# Altium schematic sheet 通信模块.SchDoc: 通信模块
size A4; Author: GAOYANG; Organization: Altium Limited; Address1: L3, 12a Rodborough Rd; Address2: Frenchs Forest; Address3: NSW; Address4: Australia 2086
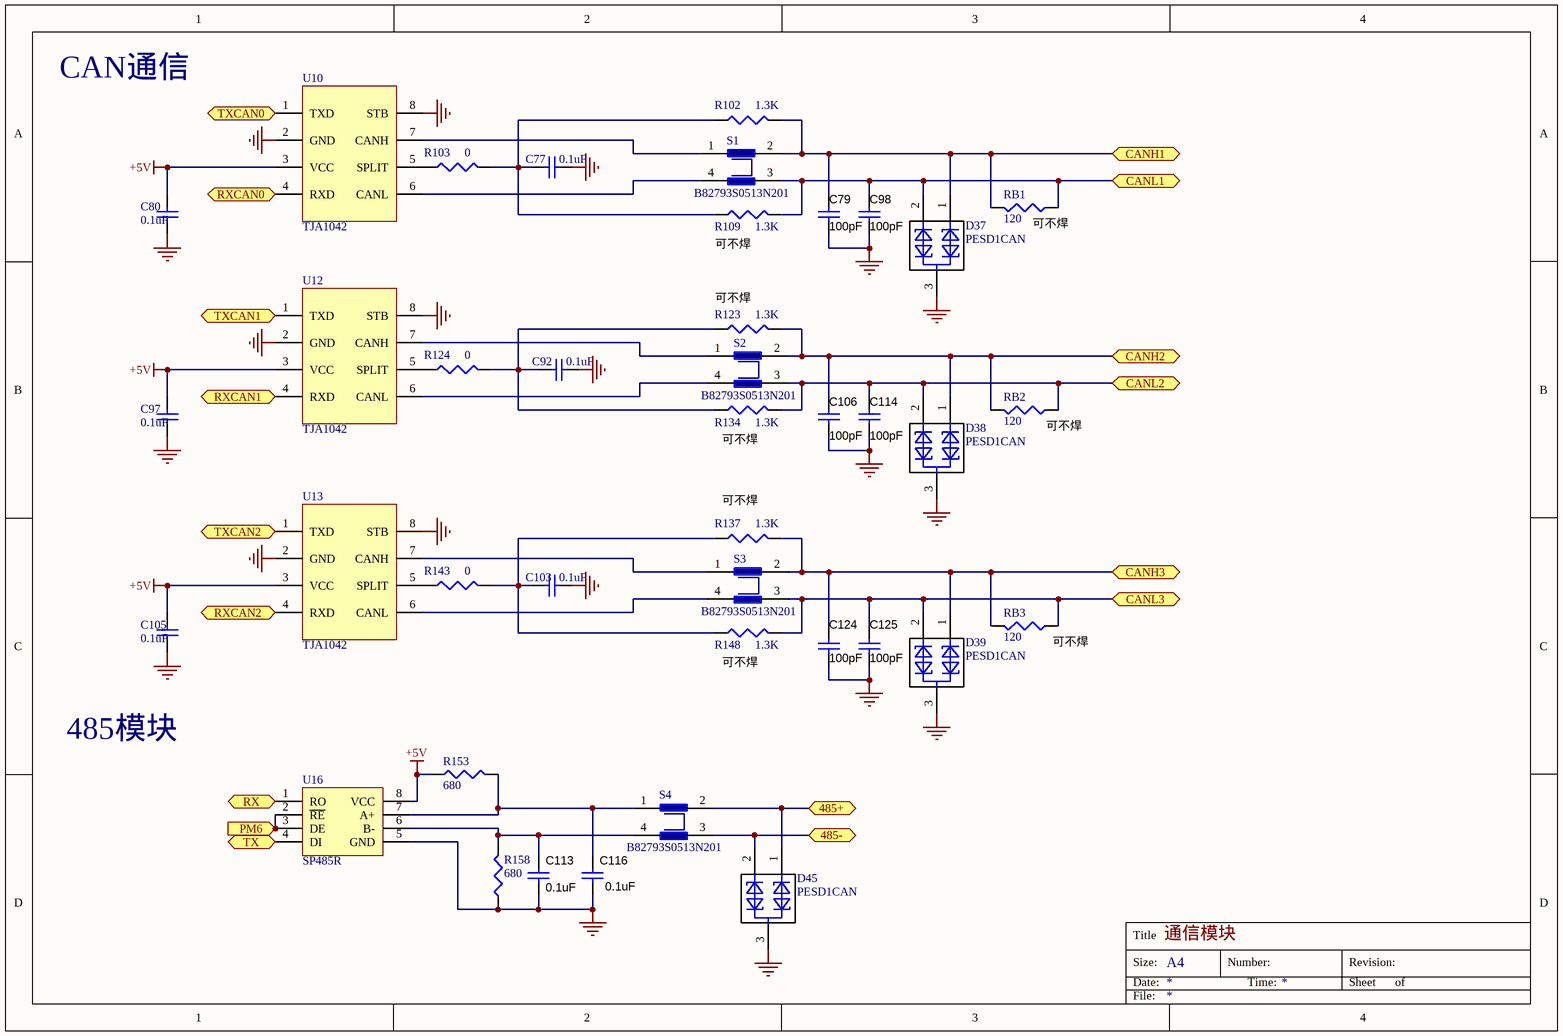
[diagram p0: 通信模块.SchDoc]

## Parts
C77  value 0.1uF  [0603-L]  (hidden comment: Cap)
C79  value 100pF  [0603-L]  (hidden comment: CC0603JRNPO9BN101)
C80  value 0.1uF  [0603-L]  (hidden comment: Cap)
C92  value 0.1uF  [0603-L]  (hidden comment: Cap)
C97  value 0.1uF  [0603-L]  (hidden comment: Cap)
C98  value 100pF  [0603-L]  (hidden comment: CC0603JRNPO9BN101)
C103  value 0.1uF  [0603-L]  (hidden comment: Cap)
C105  value 0.1uF  [0603-L]  (hidden comment: Cap)
C106  value 100pF  [0603-L]  (hidden comment: CC0603JRNPO9BN101)
C113  value 0.1uF  [0603-CAPACITOR]  (hidden comment: C1608C0G1H200JT)
C114  value 100pF  [0603-L]  (hidden comment: CC0603JRNPO9BN101)
C116  value 0.1uF  [0603-CAPACITOR]  (hidden comment: C1608C0G1H200JT)
C124  value 100pF  [0603-L]  (hidden comment: CC0603JRNPO9BN101)
C125  value 100pF  [0603-L]  (hidden comment: CC0603JRNPO9BN101)
D37  PESD1CAN  [SOT23,PESD1CAN,TO-236B]
D38  PESD1CAN  [SOT23,PESD1CAN,TO-236B]
D39  PESD1CAN  [SOT23,PESD1CAN,TO-236B]
D45  PESD1CAN  [SOT23,PESD1CAN,TO-236B]
R102  value 1.3K  [RES0805]  (hidden comment: Res3)
R103  value 0  [0603-L]  (hidden comment: Res3)
R109  value 1.3K  [RES0805]  (hidden comment: Res3)
R123  value 1.3K  [RES0805]  (hidden comment: Res3)
R124  value 0  [0603-L]  (hidden comment: Res3)
R134  value 1.3K  [RES0805]  (hidden comment: Res3)
R137  value 1.3K  [RES0805]  (hidden comment: Res3)
R143  value 0  [0603-L]  (hidden comment: Res3)
R148  value 1.3K  [RES0805]  (hidden comment: Res3)
R153  value 680  [J1-0603]  (hidden comment: Res3)
R158  value 680  [J1-0603]  (hidden comment: Res3)
RB1  value 120  [RES1206]  (hidden comment: Res3)
RB2  value 120  [RES1206]  (hidden comment: Res3)
RB3  value 120  [RES1206]  (hidden comment: Res3)
S1  B82793S0513N201  [SMD]
S2  B82793S0513N201  [SMD]
S3  B82793S0513N201  [SMD]
S4  B82793S0513N201  [SMD]
U10  TJA1042  [TJA10]
U12  TJA1042  [TJA10]
U13  TJA1042  [TJA10]
U16  SP485R  [U16]

## Ports
485+ (bidir), 485- (bidir), CANH1 (bidir), CANH2 (bidir), CANH3 (bidir), CANL1 (bidir), CANL2 (bidir), CANL3 (bidir), PM6 (in), RX (out), RXCAN0 (out), RXCAN1 (out), RXCAN2 (out), TX (in), TXCAN0 (in), TXCAN1 (in), TXCAN2 (in)

## Nets
+5V: C80.1 C97.1 C105.1 R153.1 U10.3(VCC) U12.3(VCC) U13.3(VCC) U16.8(VCC)
GND: C77.2 C79.1 C80.2 C92.2 C97.2 C98.1 C103.2 C105.2 C106.1 C113.2 C114.1 C116.2 C124.1 C125.1 D37.3 D38.3 D39.3 D45.3 R158.1 U10.2(GND) U10.8(STB) U12.2(GND) U12.8(STB) U13.2(GND) U13.8(STB) U16.5(GND)
485+: D45.1 S4.2 ; port 485+
485-: D45.2 S4.3 ; port 485-
CANH1: C79.2 D37.1 R102.1 RB1.2 S1.2 ; port CANH1
CANH2: C106.2 D38.1 R123.1 RB2.2 S2.2 ; port CANH2
CANH3: C124.2 D39.1 R137.1 RB3.2 S3.2 ; port CANH3
CANL1: C98.2 D37.2 R109.1 RB1.1 S1.3 ; port CANL1
CANL2: C114.2 D38.2 R134.1 RB2.1 S2.3 ; port CANL2
CANL3: C125.2 D39.2 R148.1 RB3.1 S3.3 ; port CANL3
PM6: U16.2(~{RE}) U16.3(DE) ; port PM6
RX: U16.1(RO) ; port RX
RXCAN0: U10.4(RXD) ; port RXCAN0
RXCAN1: U12.4(RXD) ; port RXCAN1
RXCAN2: U13.4(RXD) ; port RXCAN2
TX: U16.4(DI) ; port TX
TXCAN0: U10.1(TXD) ; port TXCAN0
TXCAN1: U12.1(TXD) ; port TXCAN1
TXCAN2: U13.1(TXD) ; port TXCAN2
NetC77_1: C77.1 R102.2 R103.1 R109.2
NetC92_1: C92.1 R123.2 R124.1 R134.2
NetC103_1: C103.1 R137.2 R143.1 R148.2
NetC113_1: C113.1 R158.2 S4.4 U16.6(B-)
NetC116_1: C116.1 R153.2 S4.1 U16.7(A+)
NetR103_2: R103.2 U10.5(SPLIT)
NetR124_2: R124.2 U12.5(SPLIT)
NetR143_2: R143.2 U13.5(SPLIT)
NetS1_1: S1.1 U10.7(CANH)
NetS1_4: S1.4 U10.6(CANL)
NetS2_1: S2.1 U12.7(CANH)
NetS2_4: S2.4 U12.6(CANL)
NetS3_1: S3.1 U13.7(CANH)
NetS3_4: S3.4 U13.6(CANL)

## Notes on the sheet
- CAN通信
- (near R109) 可不焊
- (near RB1) 可不焊
- (near R123) 可不焊
- (near R134) 可不焊
- (near RB2) 可不焊
- (near R137) 可不焊
- (near RB3) 可不焊
- (near R148) 可不焊
- 485模块
- Title
- Size:
- Date:
- A4
- Number:
- Time:
- Revision:
- Sheet
- of
- File:

## Library data of the parts
C77 C80 C92 C97 C103 C105 = Cap: Ceramic, X7R, 100V, 10%, 0603; Published: 8-Jun-2000; LatestRevisionDate: 17-Jul-2002; LatestRevisionNote: Re-released for DXP Platform.; PackageReference: RAD-0.3; Publisher: Altium Limited; PackageDescription: Radial Cap, Thru-Hole; 2 Leads; 0.3 in Pin Spacing
C79 C98 C106 C114 C124 C125 = CC0603JRNPO9BN101: Ceramic, X7R, 50V, 5%, 0603; Manufacturer: YAGEO; Cap_Case: 0603; Polarized: N; TaMax_C: 125; TaMin_C: -55; Tolerance_%: 5; VDC_V: 50; CompType: Capacitor; Value1: 101; MountType: SMT; Technology: Ceramic; Cap_F: 100pF; PartNumber: CC0603JRNPO9BN101; SymbolVersion: 2015-03-19; RoHS: Y; Dielectric: X7R; PackageReference: 0603; Value2: 50V; Published: 2015-03-19; Publisher: National Semiconductor; LatestRevisionDate: 2016-06-13; LatestRevisionNote: Added comments; ComponentLink1Description: Datasheet link; ComponentLink1URL: http://www.yageo.com/NewPortal/yageo?service=application&layer1=Consumer%20Electronics&lang=en#
C113 C116 = C1608X7R1H104KT: Ceramic, X7R, 50V, 10%; Manufacturer: TDK; Cap_Case: 0603; Polarized: N; TaMax_C: 125; TaMin_C: -55; Tolerance_%: 10; VDC_V: 50; CompType: Capacitor; Dielectric: C0G/NP0; Value1: 104; MountType: SMT; Technology: Ceramic; Cap_F: 0.1uF; PartNumber: C1608C0G1H200JT; SymbolVersion: 2015-03-19; RoHS: Y; PackageReference: 0603; Value2: 50V; Published: 2015-03-19; Publisher: National Semiconductor; LatestRevisionDate: 2016-06-13; LatestRevisionNote: Added comments; ComponentLink1Description: Datasheet link; ComponentLink1URL: https://product.tdk.com/info/zh/catalog/datasheets/mlcc_commercial_general_zh.pdf
D37-D39 D45 = PESD1CAN: PESD1CAN,SOT23, CAN ESD
R102 R103 R109 R123 R124 R134 R137 R143 R148 R153 R158 RB1-RB3 = Res3: Resistor; Published: 8-Jun-2000; LatestRevisionDate: 29-May-2009; LatestRevisionNote: IPC-7351 Footprint Added.; PackageReference: J1-0603; Publisher: Altium Limited; PackageDescription: Chip Resistor
S1-S4 = B82793S0513N201: TDK, Common-mode Choke, CAN & FlexRay